# Altium project PCB_CH438.PrjPCB
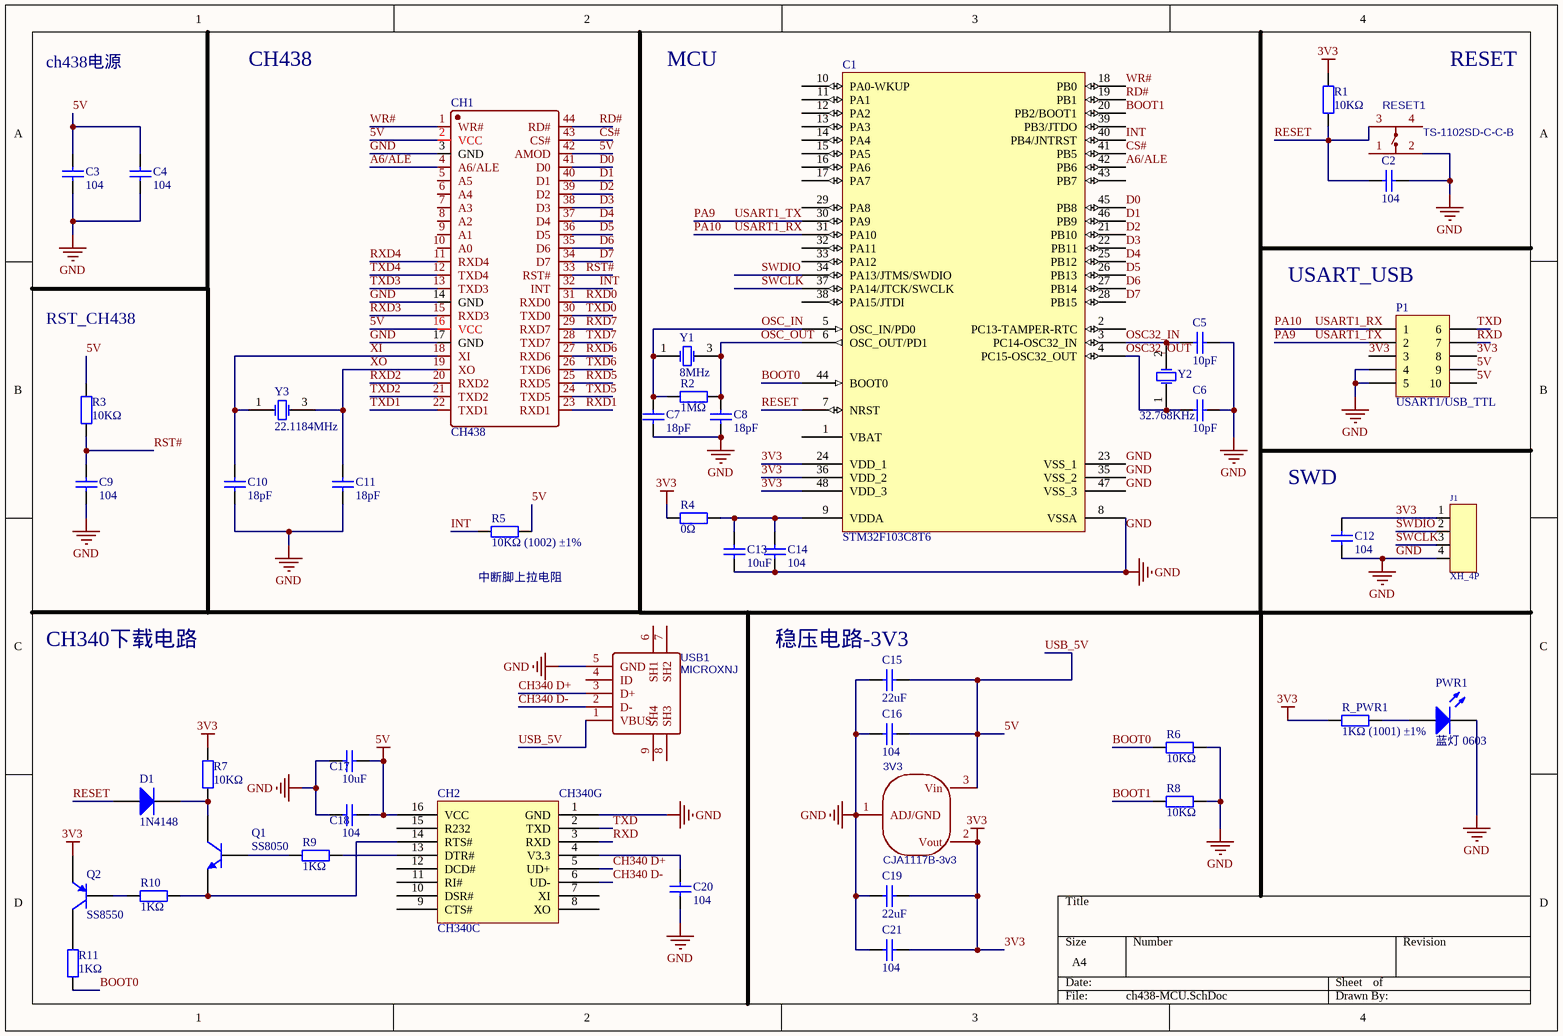
[diagram p0: ch438-MCU.SchDoc]
3 sheets, 132 parts. Net scope: global (net labels, ports and power ports of the same name join across sheets).
Board file: 转接板.PcbDoc
Sheets:
  ch438-MCU.SchDoc
  MAX232&输出.SchDoc
  去耦电容&接口.SchDoc

## Sheet ch438-MCU.SchDoc
size A4

### Parts
3V3  CJA1117B-3v3  [SOT-89_L4.5-W2.5-P1.50-LS4.2-BR]
C1  STM32F103C8T6  [LQFP48_N]
C2  104  [0603_C]
C3  104  [0603_C]
C4  104  [0603_C]
C5  10pF  [0603_C]
C6  10pF  [0603_C]
C7  18pF  [0603_C]
C8  18pF  [0603_C]
C9  104  [0603_C]
C10  18pF  [0603_C]
C11  18pF  [0603_C]
C12  104  [0603_C]
C13  10uF  [0603_C]
C14  104  [0603_C]
C15  22uF  [0603_C]
C16  104  [0603_C]
C17  10uF  [0603_C]
C18  104  [0603_C]
C19  22uF  [0603_C]
C20  104  [0603_C]
C21  104  [0603_C]
CH1  CH438  [LQFP-44_L10.0-W10.0-P0.80-LS12.0-BL]
CH2  CH340C  [SOIC-16_150mil]
D1  1N4148  [DO-35]
J1  XH_4P  [XH_4P直插弯针]
P1  USART1/USB_TTL  [HDR2X5_CEN]
PWR1  蓝灯 0603  [0603_LED_S1]
Q1  SS8050  [SOT-23(SOT-23-3)]
Q2  SS8550  [SOT-23(SOT-23-3)]
R1  10KΩ  [0603_R]
R2  1MΩ  [0603_R]
R3  10KΩ  [0603_R]
R4  0Ω  [0603_R]
R5  10KΩ (1002) ±1%  [0603_R]
R6  10KΩ  [0603_R]
R7  10KΩ  [0603_R]
R8  10KΩ  [0603_R]
R9  1KΩ  [0603_R]
R10  1KΩ  [0603_R]
R11  1KΩ  [0603_R]
R_PWR1  1KΩ (1001) ±1%  [0603_R]
RESET1  TS-1102SD-C-C-B  [SW-SMD_4P-L6.0-W6.0-P4.50-LS9.2]
USB1  MICROXNJ  [MICRO-USB-SMD_MICROXNJ]
Y1  8MHz  [SMD-3225_4P]
Y2  32.768KHz  [SMD-3215_2P FC - 135]
Y3  22.1184MHz  [SMD-3225_4P]

### Nets
3V3: 3V3.2(Vout) C1.24(VDD_1) C1.36(VDD_2) C1.48(VDD_3) C12.2 C19.2 C21.2 J1.1 P1.3 P1.8 Q2.2(E) R1.2 R4.2 R7.2 R_PWR1.1
5V: 3V3.3(Vin) C3.2 C4.2 C15.2 C16.2 C17.2 C18.1 CH1.2(VCC) CH1.16(VCC) CH1.42(AMOD) CH2.16(VCC) P1.9 P1.10 R3.2 R5.2 USB1.1(VBUS)  [also labelled USB_5V]
GND: 3V3.1(ADJ/GND) C1.8(VSSA) C1.23(VSS_1) C1.35(VSS_2) C1.47(VSS_3) C2.2 C3.1 C4.1 C5.2 C6.2 C7.1 C8.1 C9.1 C10.1 C11.1 C12.1 C13.1 C14.2 C15.1 C16.1 C17.1 C18.2 C19.1 C20.1 C21.1 CH1.3(GND) CH1.14(GND) CH1.17(GND) CH2.1(GND) J1.4 P1.4 P1.5 PWR1.K R6.2 R8.2 RESET1.2 USB1.5(GND)
A6/ALE: C1.42(PB6) CH1.4(A6/ALE)
BOOT0: C1.44(BOOT0) R6.1 R11.1
BOOT1: C1.20(PB2/BOOT1) R8.1
CH340 D+: CH2.5(UD+) USB1.3(D+)
CH340 D-: CH2.6(UD-) USB1.2(D-)
CS#: C1.41(PB5) CH1.43(CS#)
D0: C1.45(PB8) CH1.41(D0)
D1: C1.46(PB9) CH1.40(D1)
D2: C1.21(PB10) CH1.39(D2)
D3: C1.22(PB11) CH1.38(D3)
D4: C1.25(PB12) CH1.37(D4)
D5: C1.26(PB13) CH1.36(D5)
D6: C1.27(PB14) CH1.35(D6)
D7: C1.28(PB15) CH1.34(D7)
INT: C1.40(PB4/JNTRST) CH1.32(INT) R5.1
OSC32_IN: C1.3(PC14-OSC32_IN) C5.1 Y2.2(OSC2)
OSC32_OUT: C1.4(PC15-OSC32_OUT) C6.1 Y2.1(OSC1)
OSC_IN: C1.5(OSC_IN/PD0) C7.2 R2.1 Y1.1(OSC1)
OSC_OUT: C1.6(OSC_OUT/PD1) C8.2 R2.2 Y1.3(OSC2)
PA9: C1.30(PA9) P1.2  [also labelled USART1_TX]
PA10: C1.31(PA10) P1.1  [also labelled USART1_RX]
RD#: C1.19(PB1) CH1.44(RD#)
RESET: C1.7(NRST) C2.1 D1.1(A) R1.1 RESET1.3
RST#: C9.2 CH1.33(RST#) R3.1
RXD: CH2.3(RXD) P1.7
RXD0: CH1.31(RXD0)
RXD1: CH1.23(RXD1)
RXD2: CH1.20(RXD2)
RXD3: CH1.15(RXD3)
RXD4: CH1.11(RXD4)
RXD5: CH1.25(RXD5)
RXD6: CH1.27(RXD6)
RXD7: CH1.29(RXD7)
SWCLK: C1.37(PA14/JTCK/SWCLK) J1.3
SWDIO: C1.34(PA13/JTMS/SWDIO) J1.2
TXD: CH2.2(TXD) P1.6
TXD0: CH1.30(TXD0)
TXD1: CH1.22(TXD1)
TXD2: CH1.21(TXD2)
TXD3: CH1.13(TXD3)
TXD4: CH1.12(TXD4)
TXD5: CH1.24(TXD5)
TXD6: CH1.26(TXD6)
TXD7: CH1.28(TXD7)
WR#: C1.18(PB0) CH1.1(WR#)
XI: C10.2 CH1.18(XI) Y3.1(OSC1)
XO: C11.2 CH1.19(XO) Y3.3(OSC2)
NetC1_9: C1.9(VDDA) C13.2 C14.1 R4.1
NetC20_2: C20.2 CH2.4(V3.3)
NetCH2_13: CH2.13(DTR#) R9.2
NetCH2_14: CH2.14(RTS#) Q1.2(E) R10.2
NetD1_2: D1.2(K) Q1.3(C) R7.1
NetPWR1_A: PWR1.A R_PWR1.2
NetQ1_1: Q1.1(B) R9.1
NetQ2_1: Q2.1(B) R10.1
NetQ2_3: Q2.3(C) R11.2

Not connected (* = marked no-connect by the designer): C1 1(VBAT) 2(PC13-TAMPER-RTC) 10(PA0-WKUP) 11(PA1) 12(PA2) 13(PA3) 14(PA4) 15(PA5) 16(PA6) 17(PA7) 29(PA8) 32(PA11) 33(PA12) 38(PA15/JTDI) 39(PB3/JTDO) 43(PB7); CH1 5(A5) 6(A4) 7(A3) 8(A2) 9(A1) 10(A0); CH2 7(XI) 8(XO) 9(CTS#) 10(DSR#) 11(RI#) 12(DCD#) 15(R232); RESET1 1 4; USB1 4(ID) 6(SH1) 7(SH2) 8(SH3) 9(SH4)

### Notes on the sheet
- ch438电源
- CH438
- MCU
- RESET
- (near P1) USART_USB
- RST_CH438
- (near C12) SWD
- (near R5) 中断脚上拉电阻
- CH340下载电路
- (near C15) 稳压电路-3V3
- (in symbol CH340G_[C14267]) CH340G

### Library data of the parts
3V3 = CJA1117B-ADJ: BOM_Manufacturer: CJ; BOM_Supplier: LCSC; BOM_Manufacturer Part: CJA1117B-ADJ; BOM_Supplier Part: C107222; BOM_JLCPCB Part Class: Extended Part; spicePre: U; spiceSymbolName: CJA1117B-ADJ
C1 = STM32F103C8T6: STM32 ARM-based 32-bit MCU with 64 Kbytes Flash, 48-pin LQFP, Industrial Temperature; Published: 30-May-2008; DatasheetVersion: rev6, Mar-2008; PackageVersion: Mar-2008; PackageReference: LQFP48; Publisher: Altium Limited; PackageDescription: 48-Pin Low-Profile Quad Flat Pack, 7 x 7 mm Body, 0.5 mm Pitch (LQFP48); ComponentLink1Description: Manufacturer Link; ComponentLink1URL: www.st.com/stm32; ComponentLink2Description: Datasheet; ComponentLink2URL: http://www.st.com/stonline/products/literature/ds/13587.pdf
C2 C9-C12 C14 C16 C18 C20 C21 = 0603 100nF (104) 10% 50V: 贴片电容; ComponentLink1Description: 供应商链接; ComponentLink1URL: http://www.szlcsc.com/product/details_15331.html; Package: 0603; Supplier: LC; SuppliersPartNumber: C14663
C3 C4 = 0603 100pF (101) 5% 50V: 贴片电容; ComponentLink1Description: 供应商链接; ComponentLink1URL: http://www.szlcsc.com/product/details_15530.html; Package: 0603; Supplier: LC; SuppliersPartNumber: C14858
C5 C6 = 0603 10pF (100) 5% 50V: 贴片电容; ComponentLink1Description: 供应商链接; ComponentLink1URL: http://www.szlcsc.com/product/details_1986.html; Package: 0603; Supplier: LC; SuppliersPartNumber: C1634
C7 C8 = 0603 22pF (220) 5% 50V: 贴片电容; ComponentLink1Description: 供应商链接; ComponentLink1URL: http://www.szlcsc.com/product/details_2005.html; Package: 0603; Supplier: LC; SuppliersPartNumber: C1653
C13 C17 = 0603 10uF (106) 10% 10V: 贴片电容; ComponentLink1Description: 供应商链接; ComponentLink1URL: http://www.szlcsc.com/product/details_20411.html; Package: 0603; Supplier: LC; SuppliersPartNumber: C19702
C15 C19 = 0603 22uF (226) 20% 6.3V: 贴片电容; ComponentLink1Description: 供应商链接; ComponentLink1URL: http://www.szlcsc.com/product/details_60514.html; Package: 0603; Supplier: LC; SuppliersPartNumber: C59461
CH2 = CH340G_[C14267]: USB; ComponentLink1Description: 供应商链接; ComponentLink1URL: http://www.szlcsc.com/product/details_14927.html; Package: SOIC-16_150mil; Supplier: LC; SuppliersPartNumber: C14267
D1 = Diode 1N4148: High Conductance Fast Diode; Published: 8-Jun-2000; LatestRevisionDate: 17-Jul-2002; LatestRevisionNote: Re-released for DXP Platform.; DatasheetVersion: 1997; PackageReference: DO-35; Publisher: Altium Limited; PackageDescription: Diode, Axial; Body 3.8 x 1.9 mm (LxDia. max), Lead Dia. 0.53 mm (max); Code_JEDEC: DO-204-AH; ComponentLink1Description: Manufacturer Link; ComponentLink1URL: http://www.fairchildsemi.com/; ComponentLink2Description: Datasheet; ComponentLink2URL: http://www.fairchildsemi.com/ds/1N%2F1N4148.pdf
P1 = Header 5X2A: Header, 5-Pin, Dual row; LatestRevisionDate: 17-Jul-2002; LatestRevisionNote: Re-released for DXP Platform.; Publisher: Altium Limited
PWR1 = 0603 蓝灯: 发光二极管; ComponentLink1Description: 供应商链接; ComponentLink1URL: http://www.szlcsc.com/product/details_73150.html; Package: 0603; Supplier: LC; SuppliersPartNumber: C72041
Q1 = SOT-23 SS8050 Y1: 三极管; ComponentLink1Description: 供应商链接; ComponentLink1URL: http://www.szlcsc.com/product/details_2507.html; Package: SOT-23; Supplier: LC; SuppliersPartNumber: C2150
Q2 = SOT-23 SS8550 Y2: 三极管; ComponentLink1Description: 供应商链接; ComponentLink1URL: http://www.szlcsc.com/product/details_9037.html; Package: SOT-23; Supplier: LC; SuppliersPartNumber: C8542
R1 R3-R8 = 0603 10KΩ (1002) 1%: 贴片电阻; ComponentLink1Description: 供应商链接; ComponentLink1URL: http://www.szlcsc.com/product/details_26547.html; Package: 0603; Supplier: LC; SuppliersPartNumber: C25804
R2 = 0603 1MΩ (1004) 1%: 贴片电阻; ComponentLink1Description: 供应商链接; ComponentLink1URL: http://www.szlcsc.com/product/details_23662.html; Package: 0603; Supplier: LC; SuppliersPartNumber: C22935
R9-R11 R_PWR1 = 0603 1KΩ (1001) 1%: 贴片电阻; ComponentLink1Description: 供应商链接; ComponentLink1URL: http://www.szlcsc.com/product/details_21904.html; Package: 0603; Supplier: LC; SuppliersPartNumber: C21190
RESET1 = TS-1102SD-C-C-B: BOM_Manufacturer: XKB Connectivity(中国星坤); Contributor: LCSC; BOM_Supplier: LCSC; BOM_Supplier Part: C2935209; BOM_Manufacturer Part: TS-1102SD-C-C-B; spicePre: S; spiceSymbolName: TS-1102SD-C-C-B
USB1 = MICROXNJ: BOM_Manufacturer: SHOU HAN; Contributor: LCSC; BOM_Supplier: LCSC; BOM_Supplier Part: C404969; BOM_Manufacturer Part: MicroXNJ; BOM_JLCPCB Part Class: Extended Part; spicePre: U; spiceSymbolName: MICROXNJ
Y1 Y3 = SMD-3225_4P  12MHZ 20PF 10PPM: 贴片晶振; ComponentLink1Description: 供应商链接; ComponentLink1URL: http://www.szlcsc.com/product/details_9522.html; Package: SMD-3225_4P; Supplier: LC; SuppliersPartNumber: C9002
Y2 = SMD-3215_2P 32.768KHz 20ppm 12.5pF: 贴片晶振; ComponentLink1Description: 供应商链接; ComponentLink1URL: http://www.szlcsc.com/product/details_33310.html; Package: SMD-3215_2P; Supplier: LC; SuppliersPartNumber: C32346

## Sheet MAX232&输出.SchDoc
size A4
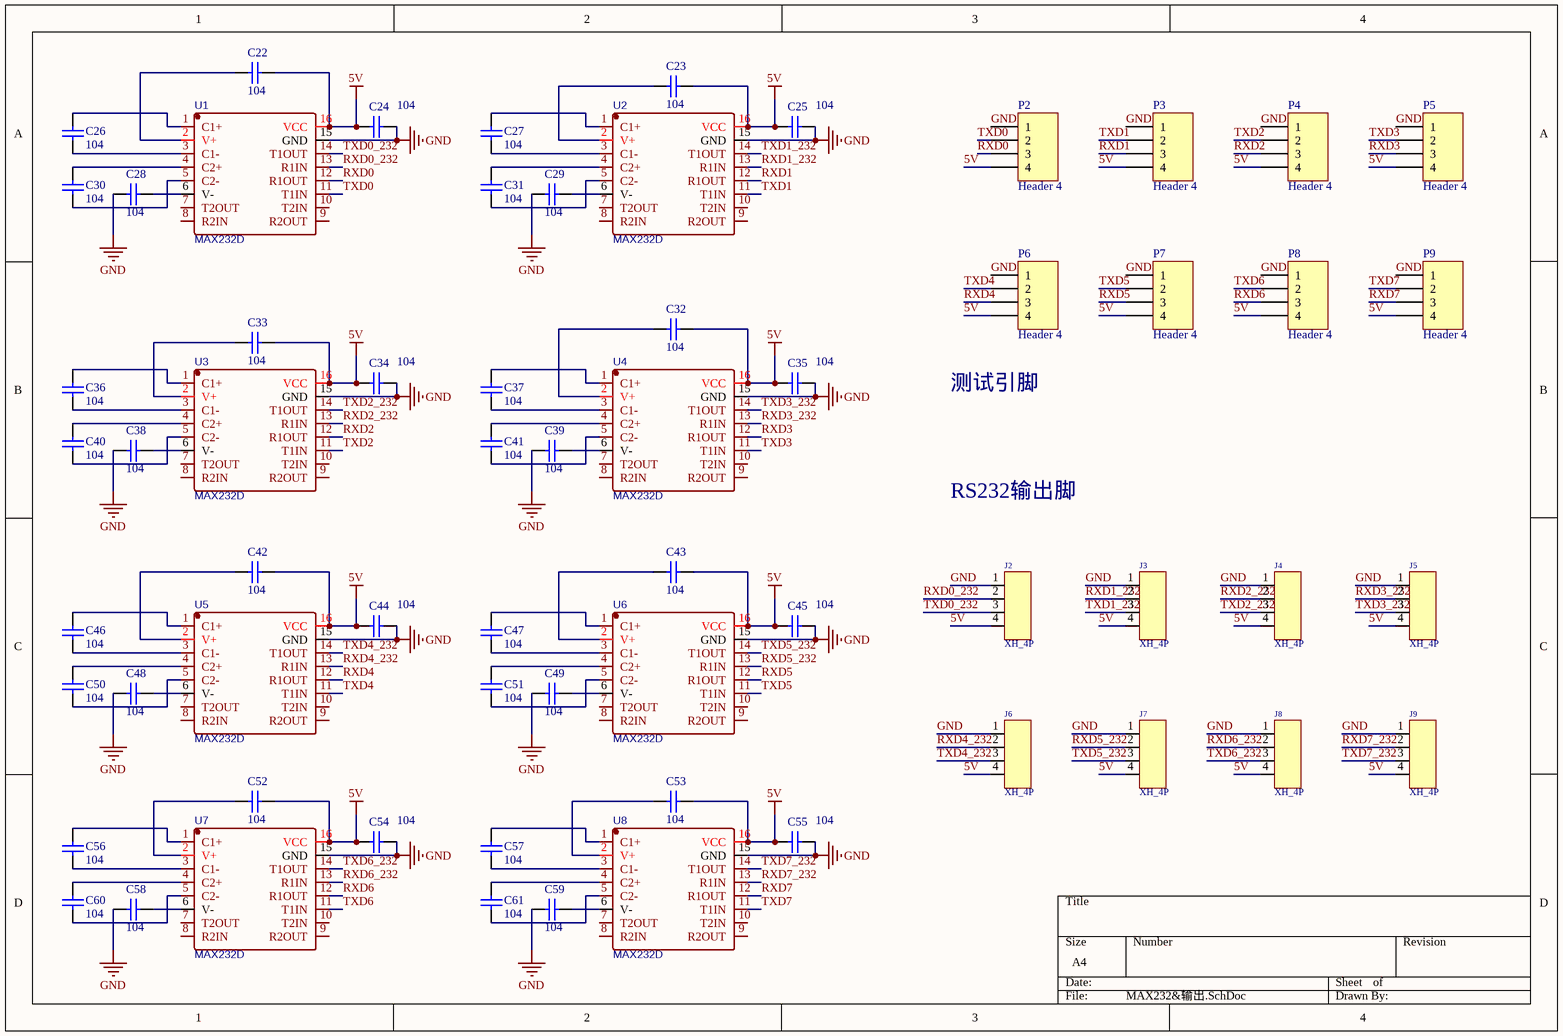
[diagram p1: MAX232&输出.SchDoc]

### Parts
C22  104  [0603_C]
C23  104  [0603_C]
C24  104  [0603_C]
C25  104  [0603_C]
C26  104  [0603_C]
C27  104  [0603_C]
C28  104  [0603_C]
C29  104  [0603_C]
C30  104  [0603_C]
C31  104  [0603_C]
C32  104  [0603_C]
C33  104  [0603_C]
C34  104  [0603_C]
C35  104  [0603_C]
C36  104  [0603_C]
C37  104  [0603_C]
C38  104  [0603_C]
C39  104  [0603_C]
C40  104  [0603_C]
C41  104  [0603_C]
C42  104  [0603_C]
C43  104  [0603_C]
C44  104  [0603_C]
C45  104  [0603_C]
C46  104  [0603_C]
C47  104  [0603_C]
C48  104  [0603_C]
C49  104  [0603_C]
C50  104  [0603_C]
C51  104  [0603_C]
C52  104  [0603_C]
C53  104  [0603_C]
C54  104  [0603_C]
C55  104  [0603_C]
C56  104  [0603_C]
C57  104  [0603_C]
C58  104  [0603_C]
C59  104  [0603_C]
C60  104  [0603_C]
C61  104  [0603_C]
J2  XH_4P  [XH_4P直插弯针]
J3  XH_4P  [XH_4P直插弯针]
J4  XH_4P  [XH_4P直插弯针]
J5  XH_4P  [XH_4P直插弯针]
J6  XH_4P  [XH_4P直插弯针]
J7  XH_4P  [XH_4P直插弯针]
J8  XH_4P  [XH_4P直插弯针]
J9  XH_4P  [XH_4P直插弯针]
P2  Header 4  [HDR1X4]
P3  Header 4  [HDR1X4]
P4  Header 4  [HDR1X4]
P5  Header 4  [HDR1X4]
P6  Header 4  [HDR1X4]
P7  Header 4  [HDR1X4]
P8  Header 4  [HDR1X4]
P9  Header 4  [HDR1X4]
U1  MAX232D  [SOIC-16_L9.9-W3.9-P1.27-LS6.0-BL]
U2  MAX232D  [SOIC-16_L9.9-W3.9-P1.27-LS6.0-BL]
U3  MAX232D  [SOIC-16_L9.9-W3.9-P1.27-LS6.0-BL]
U4  MAX232D  [SOIC-16_L9.9-W3.9-P1.27-LS6.0-BL]
U5  MAX232D  [SOIC-16_L9.9-W3.9-P1.27-LS6.0-BL]
U6  MAX232D  [SOIC-16_L9.9-W3.9-P1.27-LS6.0-BL]
U7  MAX232D  [SOIC-16_L9.9-W3.9-P1.27-LS6.0-BL]
U8  MAX232D  [SOIC-16_L9.9-W3.9-P1.27-LS6.0-BL]

### Nets
5V: C22.1 C23.1 C24.1 C25.1 C32.1 C33.1 C34.1 C35.1 C42.1 C43.1 C44.1 C45.1 C52.1 C53.1 C54.1 C55.1 J2.4 J3.4 J4.4 J5.4 J6.4 J7.4 J8.4 J9.4 P2.4 P3.4 P4.4 P5.4 P6.4 P7.4 P8.4 P9.4 U1.16(VCC) U2.16(VCC) U3.16(VCC) U4.16(VCC) U5.16(VCC) U6.16(VCC) U7.16(VCC) U8.16(VCC)
GND: C24.2 C25.2 C28.1 C29.1 C34.2 C35.2 C38.1 C39.1 C44.2 C45.2 C48.1 C49.1 C54.2 C55.2 C58.1 C59.1 J2.1 J3.1 J4.1 J5.1 J6.1 J7.1 J8.1 J9.1 P2.1 P3.1 P4.1 P5.1 P6.1 P7.1 P8.1 P9.1 U1.15(GND) U2.15(GND) U3.15(GND) U4.15(GND) U5.15(GND) U6.15(GND) U7.15(GND) U8.15(GND)
RXD0: P2.3 U1.12(R1OUT)
RXD0_232: J2.2 U1.13(R1IN)
RXD1: P3.3 U2.12(R1OUT)
RXD1_232: J3.2 U2.13(R1IN)
RXD2: P4.3 U3.12(R1OUT)
RXD2_232: J4.2 U3.13(R1IN)
RXD3: P5.3 U4.12(R1OUT)
RXD3_232: J5.2 U4.13(R1IN)
RXD4: P6.3 U5.12(R1OUT)
RXD4_232: J6.2 U5.13(R1IN)
RXD5: P7.3 U6.12(R1OUT)
RXD5_232: J7.2 U6.13(R1IN)
RXD6: P8.3 U7.12(R1OUT)
RXD6_232: J8.2 U7.13(R1IN)
RXD7: P9.3 U8.12(R1OUT)
RXD7_232: J9.2 U8.13(R1IN)
TXD0: P2.2 U1.11(T1IN)
TXD0_232: J2.3 U1.14(T1OUT)
TXD1: P3.2 U2.11(T1IN)
TXD1_232: J3.3 U2.14(T1OUT)
TXD2: P4.2 U3.11(T1IN)
TXD2_232: J4.3 U3.14(T1OUT)
TXD3: P5.2 U4.11(T1IN)
TXD3_232: J5.3 U4.14(T1OUT)
TXD4: P6.2 U5.11(T1IN)
TXD4_232: J6.3 U5.14(T1OUT)
TXD5: P7.2 U6.11(T1IN)
TXD5_232: J7.3 U6.14(T1OUT)
TXD6: P8.2 U7.11(T1IN)
TXD6_232: J8.3 U7.14(T1OUT)
TXD7: P9.2 U8.11(T1IN)
TXD7_232: J9.3 U8.14(T1OUT)
NetC22_2: C22.2 U1.2(V+)
NetC23_2: C23.2 U2.2(V+)
NetC26_1: C26.1 U1.3(C1-)
NetC26_2: C26.2 U1.1(C1+)
NetC27_1: C27.1 U2.3(C1-)
NetC27_2: C27.2 U2.1(C1+)
NetC28_2: C28.2 U1.6(V-)
NetC29_2: C29.2 U2.6(V-)
NetC30_1: C30.1 U1.5(C2-)
NetC30_2: C30.2 U1.4(C2+)
NetC31_1: C31.1 U2.5(C2-)
NetC31_2: C31.2 U2.4(C2+)
NetC32_2: C32.2 U4.2(V+)
NetC33_2: C33.2 U3.2(V+)
NetC36_1: C36.1 U3.3(C1-)
NetC36_2: C36.2 U3.1(C1+)
NetC37_1: C37.1 U4.3(C1-)
NetC37_2: C37.2 U4.1(C1+)
NetC38_2: C38.2 U3.6(V-)
NetC39_2: C39.2 U4.6(V-)
NetC40_1: C40.1 U3.5(C2-)
NetC40_2: C40.2 U3.4(C2+)
NetC41_1: C41.1 U4.5(C2-)
NetC41_2: C41.2 U4.4(C2+)
NetC42_2: C42.2 U5.2(V+)
NetC43_2: C43.2 U6.2(V+)
NetC46_1: C46.1 U5.3(C1-)
NetC46_2: C46.2 U5.1(C1+)
NetC47_1: C47.1 U6.3(C1-)
NetC47_2: C47.2 U6.1(C1+)
NetC48_2: C48.2 U5.6(V-)
NetC49_2: C49.2 U6.6(V-)
NetC50_1: C50.1 U5.5(C2-)
NetC50_2: C50.2 U5.4(C2+)
NetC51_1: C51.1 U6.5(C2-)
NetC51_2: C51.2 U6.4(C2+)
NetC52_2: C52.2 U7.2(V+)
NetC53_2: C53.2 U8.2(V+)
NetC56_1: C56.1 U7.3(C1-)
NetC56_2: C56.2 U7.1(C1+)
NetC57_1: C57.1 U8.3(C1-)
NetC57_2: C57.2 U8.1(C1+)
NetC58_2: C58.2 U7.6(V-)
NetC59_2: C59.2 U8.6(V-)
NetC60_1: C60.1 U7.5(C2-)
NetC60_2: C60.2 U7.4(C2+)
NetC61_1: C61.1 U8.5(C2-)
NetC61_2: C61.2 U8.4(C2+)

Not connected (* = marked no-connect by the designer): U1 7(T2OUT) 8(R2IN) 9(R2OUT) 10(T2IN); U2 7(T2OUT) 8(R2IN) 9(R2OUT) 10(T2IN); U3 7(T2OUT) 8(R2IN) 9(R2OUT) 10(T2IN); U4 7(T2OUT) 8(R2IN) 9(R2OUT) 10(T2IN); U5 7(T2OUT) 8(R2IN) 9(R2OUT) 10(T2IN); U6 7(T2OUT) 8(R2IN) 9(R2OUT) 10(T2IN); U7 7(T2OUT) 8(R2IN) 9(R2OUT) 10(T2IN); U8 7(T2OUT) 8(R2IN) 9(R2OUT) 10(T2IN)

### Notes on the sheet
- 测试引脚
- RS232输出脚

### Library data of the parts
C22-C61 = 0603 100nF (104) 10% 50V: 贴片电容; ComponentLink1Description: 供应商链接; ComponentLink1URL: http://www.szlcsc.com/product/details_15331.html; Package: 0603; Supplier: LC; SuppliersPartNumber: C14663
P2-P9 = Header 4: Header, 4-Pin; LatestRevisionDate: 17-Jul-2002; LatestRevisionNote: Re-released for DXP Platform.; Publisher: Altium Limited
U1-U8 = MAX232D: BOM_Manufacturer: Texas Instruments; Contributor: LCSC; BOM_Supplier: LCSC; BOM_Supplier Part: C350552; BOM_Manufacturer Part: MAX232D; BOM_JLCPCB Part Class: Extended Part; spicePre: U; spiceSymbolName: MAX232D

## Sheet 去耦电容&接口.SchDoc
size A4
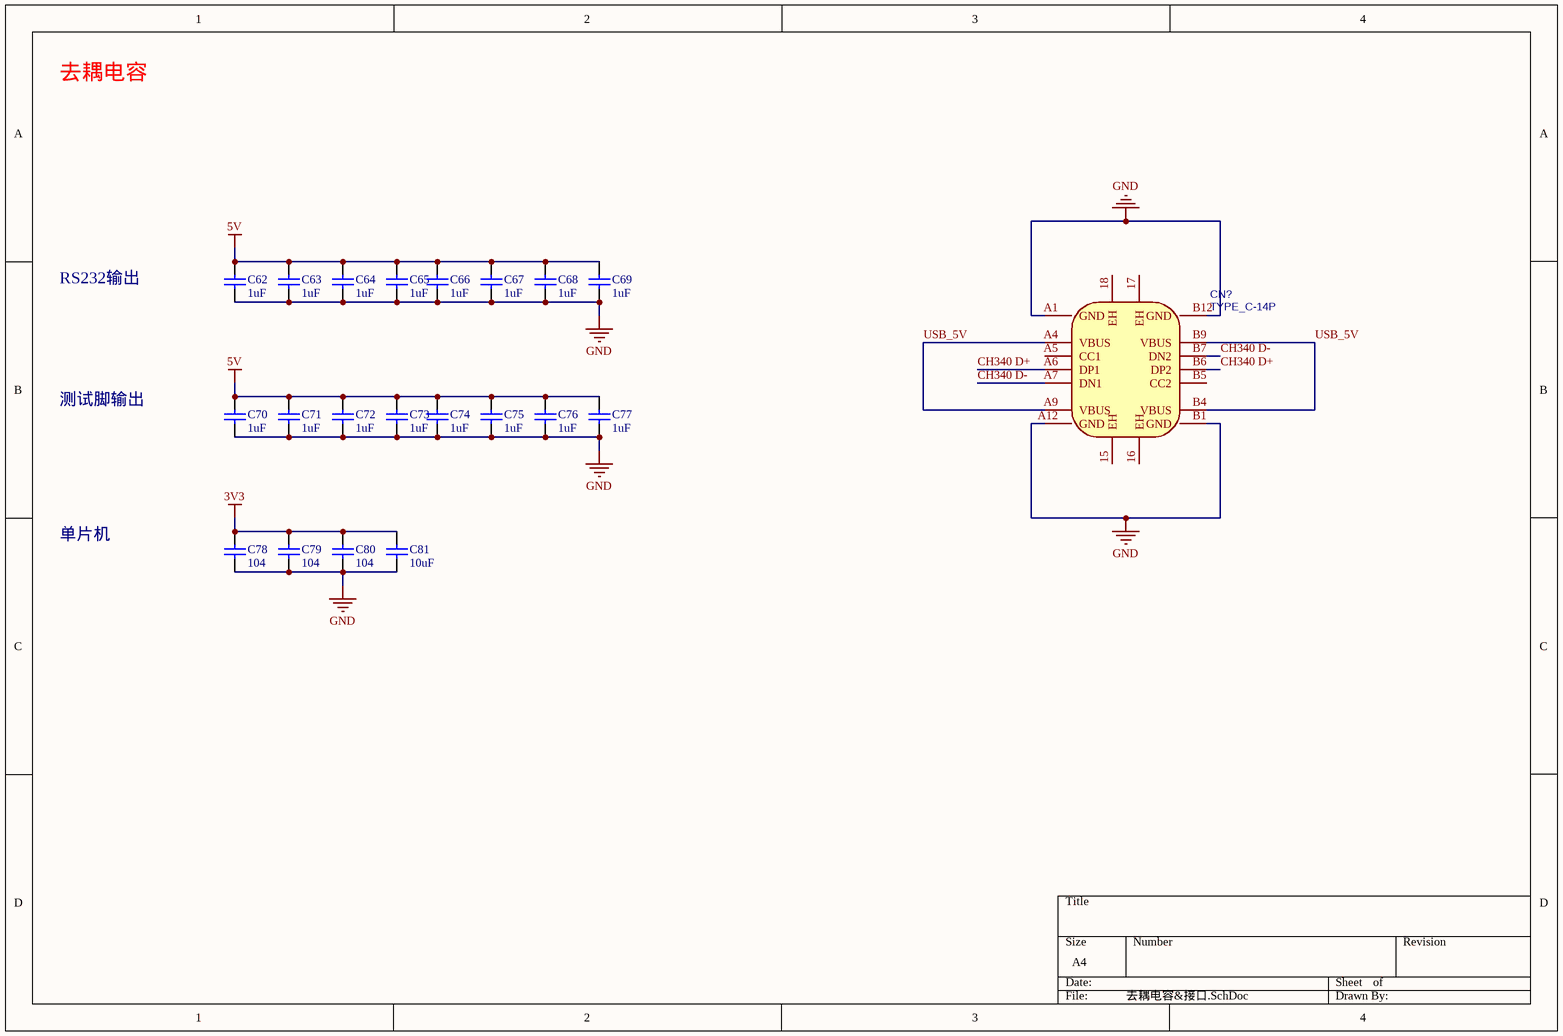
[diagram p2: 去耦电容&接口.SchDoc]

### Parts
C62  1uF  [0603_C]
C63  1uF  [0603_C]
C64  1uF  [0603_C]
C65  1uF  [0603_C]
C66  1uF  [0603_C]
C67  1uF  [0603_C]
C68  1uF  [0603_C]
C69  1uF  [0603_C]
C70  1uF  [0603_C]
C71  1uF  [0603_C]
C72  1uF  [0603_C]
C73  1uF  [0603_C]
C74  1uF  [0603_C]
C75  1uF  [0603_C]
C76  1uF  [0603_C]
C77  1uF  [0603_C]
C78  104  [0603_C]
C79  104  [0603_C]
C80  104  [0603_C]
C81  10uF  [0603_C]
CN?  TYPE_C-14P  [USB-C-SMD_KH-TYPE-C-16P]

### Nets
3V3: C78.2 C79.2 C80.2 C81.2
5V: C62.2 C63.2 C64.2 C65.2 C66.2 C67.2 C68.2 C69.2 C70.2 C71.2 C72.2 C73.2 C74.2 C75.2 C76.2 C77.2 CN?.A4(VBUS) CN?.A9(VBUS) CN?.B4(VBUS) CN?.B9(VBUS)  [also labelled USB_5V]
GND: C62.1 C63.1 C64.1 C65.1 C66.1 C67.1 C68.1 C69.1 C70.1 C71.1 C72.1 C73.1 C74.1 C75.1 C76.1 C77.1 C78.1 C79.1 C80.1 C81.1 CN?.A1(GND) CN?.A12(GND) CN?.B1(GND) CN?.B12(GND)
CH340 D+: CN?.A6(DP1) CN?.B6(DP2)
CH340 D-: CN?.A7(DN1) CN?.B7(DN2)

Not connected (* = marked no-connect by the designer): CN? 15(EH) 16(EH) 17(EH) 18(EH) A5(CC1) B5(CC2)

### Notes on the sheet
- 去耦电容
- RS232输出
- 测试脚输出
- 单片机

### Library data of the parts
C62-C81 = 0603 1uF (105) 10% 50V: 贴片电容; ComponentLink1Description: 供应商链接; ComponentLink1URL: http://www.szlcsc.com/product/details_16531.html; Package: 0603; Supplier: LC; SuppliersPartNumber: C15849
CN? = TYPE_C-14P: BOM_Manufacturer: Korean Hroparts Elec; BOM_Manufacturer Part: TYPE-C-31-M-18; Contributor: LCSC; BOM_Supplier: LCSC; BOM_Supplier Part: C530609; spicePre: U; spiceSymbolName: TYPE-C-31-M-18

## Nets that join several sheets
3V3: ch438-MCU (15 pins), 去耦电容&接口 (C78.2 C79.2 C80.2 C81.2)
5V: ch438-MCU (16 pins), MAX232&输出 (40 pins), 去耦电容&接口 (20 pins)
GND: ch438-MCU (37 pins), MAX232&输出 (40 pins), 去耦电容&接口 (24 pins)
CH340 D+: ch438-MCU (CH2.5 USB1.3), 去耦电容&接口 (CN?.A6 CN?.B6)
CH340 D-: ch438-MCU (CH2.6 USB1.2), 去耦电容&接口 (CN?.A7 CN?.B7)
RXD0: ch438-MCU (CH1.31), MAX232&输出 (P2.3 U1.12)
RXD1: ch438-MCU (CH1.23), MAX232&输出 (P3.3 U2.12)
RXD2: ch438-MCU (CH1.20), MAX232&输出 (P4.3 U3.12)
RXD3: ch438-MCU (CH1.15), MAX232&输出 (P5.3 U4.12)
RXD4: ch438-MCU (CH1.11), MAX232&输出 (P6.3 U5.12)
RXD5: ch438-MCU (CH1.25), MAX232&输出 (P7.3 U6.12)
RXD6: ch438-MCU (CH1.27), MAX232&输出 (P8.3 U7.12)
RXD7: ch438-MCU (CH1.29), MAX232&输出 (P9.3 U8.12)
TXD0: ch438-MCU (CH1.30), MAX232&输出 (P2.2 U1.11)
TXD1: ch438-MCU (CH1.22), MAX232&输出 (P3.2 U2.11)
TXD2: ch438-MCU (CH1.21), MAX232&输出 (P4.2 U3.11)
TXD3: ch438-MCU (CH1.13), MAX232&输出 (P5.2 U4.11)
TXD4: ch438-MCU (CH1.12), MAX232&输出 (P6.2 U5.11)
TXD5: ch438-MCU (CH1.24), MAX232&输出 (P7.2 U6.11)
TXD6: ch438-MCU (CH1.26), MAX232&输出 (P8.2 U7.11)
TXD7: ch438-MCU (CH1.28), MAX232&输出 (P9.2 U8.11)